# Altium project ARM.PrjPcb (part 2 of 2)

## Sheet 04-Accel.SchDoc
size A
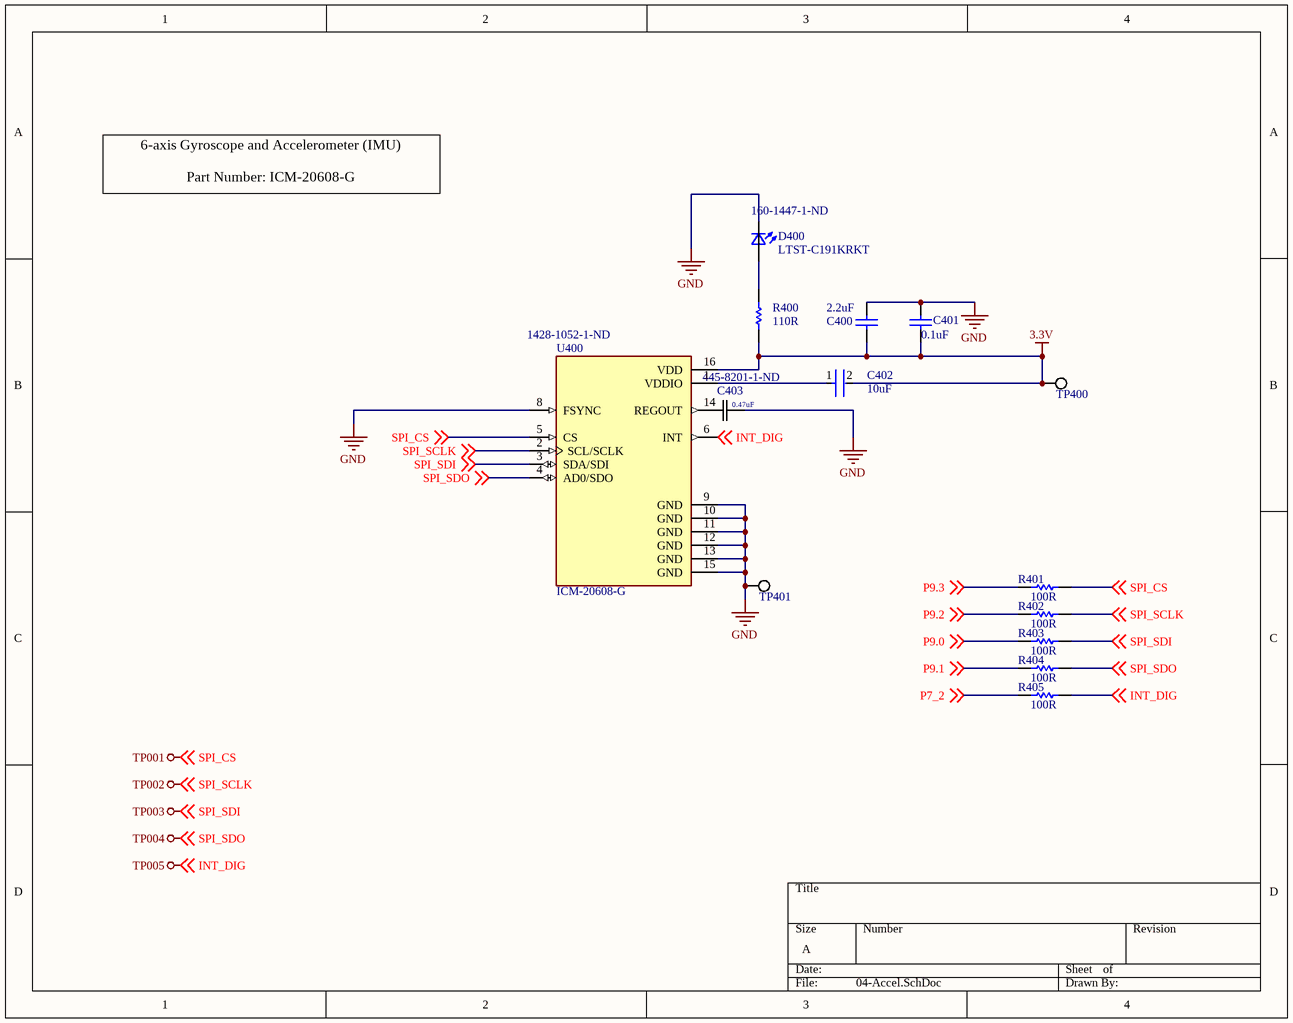
[diagram p3: 04-Accel.SchDoc]

### Parts
C400  2.2uF  [CAPC2013X145X50ML20T25]
C401  0.1uF  [CAPC2013X145X50LL20T25]
C402  10uF  [FP-C0805C-DN-MFG]
C403  0.47uF  Supplier Part Number 2: 445-8201-1-ND  [CAP_2012_TDK]
D400  LTST-C191KRKT  Supplier Part Number 1: 160-1447-1-ND  [0603]
R400  110R  [RESC2013X60X40NL20T25]
R401  100R  [RESC2013X60X40ML20T25]
R402  100R  [RESC2013X60X40ML20T25]
R403  100R  [RESC2013X60X40ML20T25]
R404  100R  [RESC2013X60X40ML20T25]
R405  100R  [RESC2013X60X40ML20T25]
TP400  5019  [KSTN-5019_V]  (value not drawn)
TP401  5019  [KSTN-5019_V]  (value not drawn)
U400  ICM-20608-G  Supplier Part Number 1: 1428-1052-1-ND  [PQFN50P300X300X80-16N]

### Nets
3.3V: C400.1 C401.1 C402.2 R400.1 TP400.1 U400.16(VDD)
GND: C400.2 C401.2 C403.2 D400.1(K2) TP401.1 U400.8(FSYNC) U400.9(GND) U400.10(GND) U400.11(GND) U400.12(GND) U400.13(GND) U400.15(GND)
TP001: R401.2 U400.5(CS) ; off-sheet SPI_CS  [also labelled SPI_CS]
TP002: R402.2 U400.2(SCL/SCLK) ; off-sheet SPI_SCLK  [also labelled SPI_SCLK]
TP003: R403.2 U400.3(SDA/SDI) ; off-sheet SPI_SDI  [also labelled SPI_SDI]
TP004: R404.2 U400.4(AD0/SDO) ; off-sheet SPI_SDO  [also labelled SPI_SDO]
TP005: R405.2 U400.6(INT) ; off-sheet INT_DIG  [also labelled INT_DIG]
P7_2: R405.1 ; off-sheet P7_2
P9.0: R403.1 ; off-sheet P9.0
P9.1: R404.1 ; off-sheet P9.1
P9.2: R402.1 ; off-sheet P9.2
P9.3: R401.1 ; off-sheet P9.3
NetC402_1: C402.1 U400.1(VDDIO)
NetD400_2: D400.2(A2) R400.2

Not connected (* = marked no-connect by the designer): C403 1; U400 14(REGOUT)

### Notes on the sheet
- 6-axis Gyroscope and Accelerometer (IMU)
  Part Number: ICM-20608-G

### Library data of the parts
C400 = CMP-1036-04819-2: Part Number: C0805C225K9PACTU; Manufacturer: Kemet
C401 = CMP-1036-04391-2: Manufacturer: Kemet; Part Number: C0805C104K9RACTU
C402 = CMP-1036-03808-3: CAP CER 10000PF 10V X7R 0805; Manufacturer Part Number: C0805C103K8RACTU; Manufacturer: KEMET; Material: Ceramic; Value: 10,000 pF; Temperature Coefficient: 30ppm/°C; Tolerance: 0.1; RoHS: TRUE; Lead Free: Yes; Temperature: -55°C to +125°C; Device Class L2: Capacitors; Temperature Characteristic: X7R; Device Class L1: Passive Components; Mouser Description: Multilayer Ceramic Capacitors MLCC - SMD/SMT 10volts 10000pF X7R 10%; Category: Cap; Ipc Land Pattern Name: CAPC200125X78; Height: 0.88mm; ComponentLink2URL: https://content.kemet.com/datasheets/KEM_C1003_C0G_SMD.pdf; Capacitance: 10,000 pF; Temperature Range High: +125°C; Automotive: No; ComponentLink2Description: Datasheet; Octopart: https://octopart.com/c0805c103k8ractu-kemet-12595572; Device Class L3: Ceramic Capacitors; Temperature Range Low: -55°C; Package: C0805C-DN; Voltage Rating: 10 V; Digikey Description: CAP CER 10000PF 10V X7R 0805
C403 = CGJ4J2X7R0J474K125AA: Cap Ceramic 0.47uF 6.3V X7R 10% Pad SMD 0805 125C Automotive T/R; Mfr_Name: TDK; Capacitance: 470nF; Ratings: COTS; Supplier 1: Digi-Key; Supplier 2: Digi-Key; Manufacturer: TDK; Manufacturer Part Number: CGJ4J2X7R0J474K125AA; RoHS: Yes; Category: Ceramic Capacitors; Stock 2: 1790; Pricing 2: 1=0.43000, 10=0.30400, 50=0.23020, 100=0.20040, 500=0.14848, 1000=0.12620 (USD); Mount: Surface Mount; Case/Package: 0805; Case Code (Metric): 2012; Case Code (Imperial): 0805; Weight: 0.000194oz; Min Operating Temperature: -55°C; Max Operating Temperature: 125°C; Voltage Rating: 6.3V; Tolerance: 10%; Packaging: Tape and Reel; Termination: SMD/SMT; Series: CGJ; Package Quantity: 2000; Voltage Rating (DC): 6.3V; Dielectric: X7R; Resistor Type: Ceramic; Length: 2mm; Width: 0.049inch; Height: 1.25mm; Thickness: 0.053inch; Depth: 1.25mm; Radiation Hardening: No; ComponentLink1URL: https://datasheet.ciiva.com/15192/getdatasheetpartid-712880-15192524.pdf?src-supplier=Verical; ComponentLink1Description: https://datasheet.ciiva.com/15192/getdatasheetpartid-712880-15192524.pdf?src-supplier=Verical; ComponentLink2URL: https://datasheet.ciiva.com/24216/mlcc-highreliability-general-en-520187-24216918.pdf?src-supplier=Mouser; ComponentLink2Description: https://datasheet.ciiva.com/24216/mlcc-highreliability-general-en-520187-24216918.pdf?src-supplier=Mouser
D400 = LTST-C191KRKT: LED Uni-Color Red 639nm 2-Pin Chip LED T/R / LED RED CLEAR 0603 SMD; Manufacturer: Vishay Lite-On; Lens Color: Colorless; Power Rating: 75mW; Luminous Intensity: 54mcd; Viewing Angle: 130°; Forward Voltage: 2V; Lens Style: Clear,Diffused,Colorless,Rectangular; Forward Current: 30mA; Dominant Wavelength: 631nm; Test Current: 20mA; Number of Elements: 1; Reverse Voltage: 5V; Package: None; MP: LTST-C191KRKT; Value: *; Availability: Unavailable; Price: None; Supplier 1: Digi-Key; Manufacturer Part Number: LTST-C191KRKT; RoHS: Yes; Category: LEDs; Stock 1: 862758; Pricing 1: 1=0.26000, 10=0.14100, 100=0.06560, 500=0.06060, 1000=0.04747, 2000=0.04646 (USD); Mount: Surface Mount; Case/Package: 0603; Number of Pins: 2; Color: Red; Case Code (Metric): 1608; Case Code (Imperial): 0603; Min Operating Temperature: -55°C; Max Operating Temperature: 85°C; Packaging: Tape and Reel; Package Quantity: 1; Illumination Color: Red; Lens Transparency: Clear; Power Dissipation: 75mW; Wavelength: 639nm; Number of LEDs: 1; Voltage: 2V; Length: 1.6mm; Width: 0.8mm; Height: 0.55mm; Depth: 0.8mm; Radiation Hardening: No; Lead Free: Lead Free; RoHS Compliant: Yes; ComponentLink1URL: https://datasheet.ciiva.com/12400/lite-on-ltst-c191krkt-190135-12400910.pdf?src-supplier=Mouser; ComponentLink1Description: https://datasheet.ciiva.com/12400/lite-on-ltst-c191krkt-190135-12400910.pdf?src-supplier=Mouser; ComponentLink2URL: https://datasheet.ciiva.com/16212/ltst-c191krkt-16212419.pdf?src-supplier=Future+Electronics; ComponentLink2Description: https://datasheet.ciiva.com/16212/ltst-c191krkt-16212419.pdf?src-supplier=Future+Electronics; ComponentLink3URL: https://datasheet.ciiva.com/15117/getdatasheetpartid-141922-15117737.pdf?src-supplier=Verical; ComponentLink3Description: https://datasheet.ciiva.com/15117/getdatasheetpartid-141922-15117737.pdf?src-supplier=Verical; ComponentLink4URL: https://datasheet.ciiva.com/11773/0900766b80dc02b2-11773601.pdf?src-supplier=Rs; ComponentLink4Description: https://datasheet.ciiva.com/11773/0900766b80dc02b2-11773601.pdf?src-supplier=Rs; ComponentLink5URL: https://datasheet.ciiva.com/2109/s-110-ltst-c191krkt-2109971.pdf?src-supplier=Digi-Key; ComponentLink5Description: https://datasheet.ciiva.com/2109/s-110-ltst-c191krkt-2109971.pdf?src-supplier=Digi-Key; ComponentLink6URL: https://datasheet.ciiva.com/2109/s-110-ltst-c191krkt-2109970.pdf?src-supplier=Digi-Key; ComponentLink6Description: https://datasheet.ciiva.com/2109/s-110-ltst-c191krkt-2109970.pdf?src-supplier=Digi-Key; ComponentLink7URL: https://datasheet.ciiva.com/2109/s-110-ltst-c191krkt-2109972.pdf?src-supplier=Digi-Key; ComponentLink7Description: https://datasheet.ciiva.com/2109/s-110-ltst-c191krkt-2109972.pdf?src-supplier=Digi-Key
R400 = CMP-2001-00585-1: Part Number: ERA6AEB111V; Manufacturer: Panasonic
R401-R405 = CMP-2001-00580-1: Manufacturer: Panasonic; Part Number: ERA6AEB101V
TP400 TP401 = CMP-1672-00008-1: Test Point, 1 Position SMD, RoHS, Tape and Reel; Manufacturer 1: Keystone Electronics; ComponentLink1Description: Manufacturer URL; Package Quantity: 1000; DatasheetVersion: 03/2014; Packaging: Tape and Reel; ComponentLink2URL: http://www.keyelco.com/product-pdf.cfm?p=1357; ComponentLink1URL: http://www.keyelco.com/; Mount: Surface Mount; Contact Plating: Silver; PackageDescription: 1-Pin Surface Mount Device, Body 3.81 x 2.03 mm; Pins: 1; RoHSCompliant: True; Mounting Technology: Surface Mount; ComponentLink2Description: Datasheet; PackageReference: 5019; Supplier 1: Digi-Key; Supplier Part Number 1: 36-5019CT-ND; Manufacturer Part Number 1: 5019; RoHS: Yes; Category: Connectors; Stock 1: 1316816; Pricing 1: 1=0.34000, 25=0.27360, 100=0.22340, 250=0.20064, 500=0.19152 (USD); Number of Pins: 1; Material: Bronze; Contact Material: Bronze; Series: 5019; Termination: SMD/SMT; Height: 0.09inch; RoHS Compliant: Yes; REACH SVHC: No SVHC; Lead Free: Lead Free; ComponentLink3URL: https://datasheet.ciiva.com/16318/m60-2p61-16318395.pdf?src-supplier=Future+Electronics; ComponentLink3Description: https://datasheet.ciiva.com/16318/m60-2p61-16318395.pdf?src-supplier=Future+Electronics; ComponentLink4URL: https://datasheet.ciiva.com/16885/70182998-16885945.pdf?src-supplier=Allied+Electronics; ComponentLink4Description: https://datasheet.ciiva.com/16885/70182998-16885945.pdf?src-supplier=Allied+Electronics; ComponentLink5URL: https://datasheet.ciiva.com/14848/m60-2p61-14848437.pdf?src-supplier=Digi-Key; ComponentLink5Description: https://datasheet.ciiva.com/14848/m60-2p61-14848437.pdf?src-supplier=Digi-Key; ComponentLink6URL: https://datasheet.ciiva.com/14848/m60-2p61-14848438.pdf?src-supplier=Digi-Key; ComponentLink6Description: https://datasheet.ciiva.com/14848/m60-2p61-14848438.pdf?src-supplier=Digi-Key; ComponentLink7URL: https://datasheet.ciiva.com/14848/m60-2p61-14848439.pdf?src-supplier=Digi-Key; ComponentLink7Description: https://datasheet.ciiva.com/14848/m60-2p61-14848439.pdf?src-supplier=Digi-Key
U400 = ICM-20608-G: MotionTracking Device Digital Output 1.8V 16-Pin LGA / IMU ACCEL/GYRO I2C/SPI 16LGA; MF: TDK InvenSense; Sensor Type: Accelerometer,Gyroscope,3 Axis; Output Type: SPI,I2C,Digital; Package: LGA-16 InvenSense; Purchase-URL: https://pricing.snapeda.com/search/part/ICM-20608-G/?ref=eda; Value: *; Price: None; Availability: Good; MP: ICM-20608-G; SnapEDA_Link: https://www.snapeda.com/parts/ICM-20608-G/TDK%20InvenSense/view-part/196551/?ref=snap; Supplier 1: Digi-Key; Manufacturer: TDK InvenSense; Manufacturer Part Number: ICM-20608-G; RoHS: No; Category: Inertial Measurement Units (IMUs); Stock 1: 18416; Pricing 1: 1=7.78000, 5=6.86600, 10=6.06500, 25=4.92040, 50=4.34820, 100=4.23370, 500=3.54718, 1000=3.31832 (USD); Mount: Surface Mount; Case/Package: LGA; Number of Pins: 16; Min Operating Temperature: -40°C; Max Operating Temperature: 85°C; RoHS Compliant: No; ComponentLink1URL: https://www.invensense.com/wp-content/uploads/2015/03/ICM-20608-G-Product-Brief-v1.0.pdf?src-supplier=Digi-Key; ComponentLink1Description: https://www.invensense.com/wp-content/uploads/2015/03/ICM-20608-G-Product-Brief-v1.0.pdf?src-supplier=Digi-Key

## Sheet 05-UARTBridge.SchDoc
size A
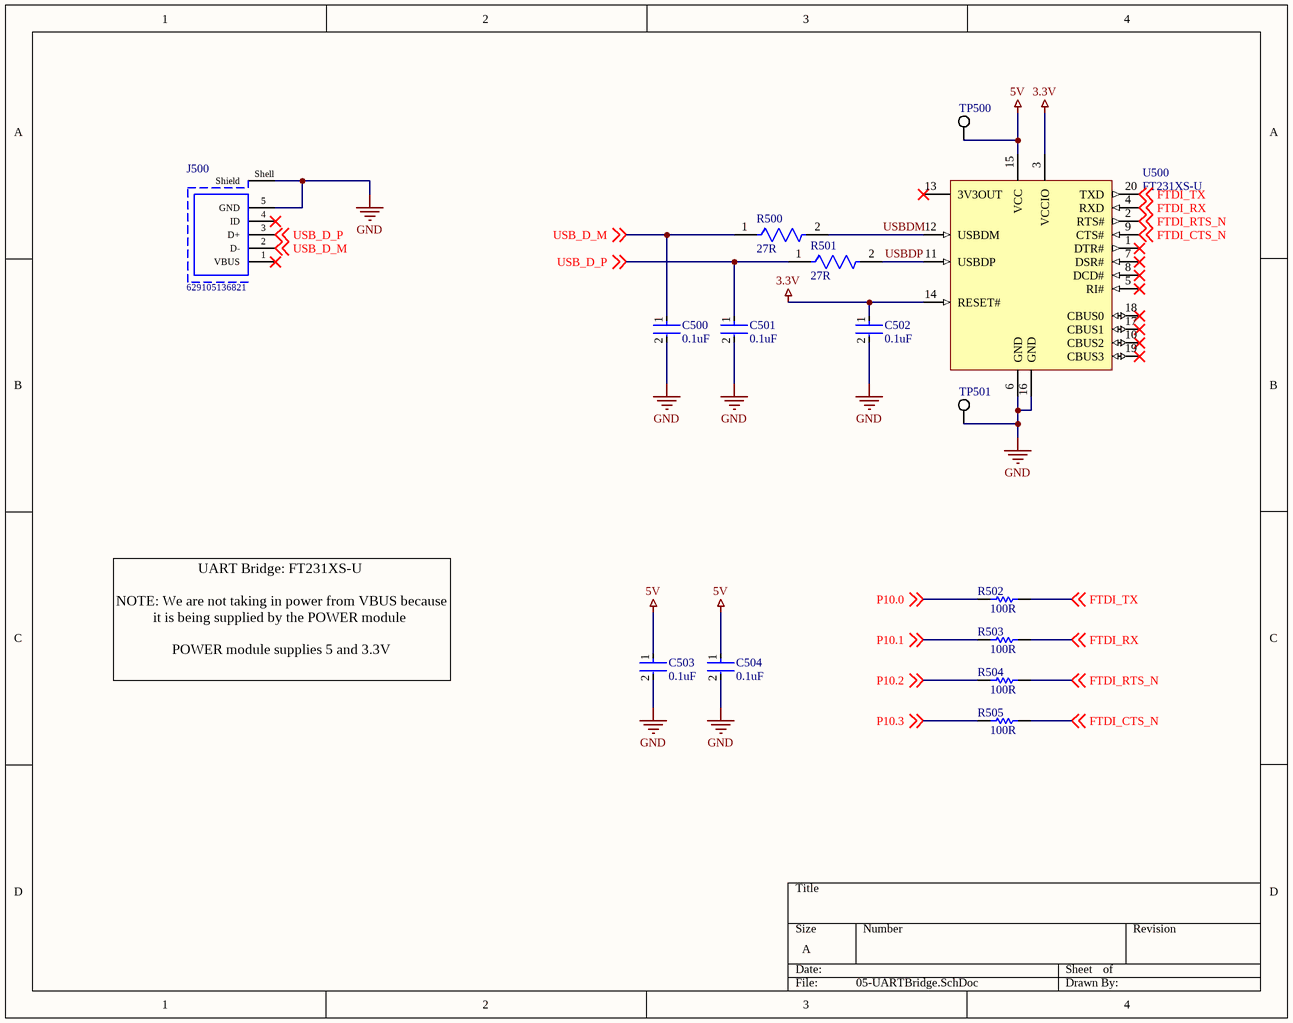
[diagram p4: 05-UARTBridge.SchDoc]

### Parts
C500  0.1uF  [FP-CL21-IPC_C]
C501  0.1uF  [FP-CL21-IPC_C]
C502  0.1uF  [FP-CL21-IPC_C]
C503  0.1uF  [FP-CL21-IPC_C]
C504  0.1uF  [FP-CL21-IPC_C]
J500  629105136821  [629105136821]
R500  27R  [FP-CRGCQ0805-IPC_C]
R501  27R  [FP-CRGCQ0805-IPC_C]
R502  100R  [RESC2013X60X40ML20T25]
R503  100R  [RESC2013X60X40ML20T25]
R504  100R  [RESC2013X60X40ML20T25]
R505  100R  [RESC2013X60X40ML20T25]
TP500  5019  [KSTN-5019_V]  (value not drawn)
TP501  5019  [KSTN-5019_V]  (value not drawn)
U500  FT231XS-U  [SSOP-20_L]

### Nets
3.3V: C502.1 U500.3(VCCIO) U500.14(RESET#)
5V: C503.1 C504.1 TP500.1 U500.15(VCC)
GND: C500.2 C501.2 C502.2 C503.2 C504.2 J500.5(GND) J500.Shell(Shield) TP501.1 U500.6(GND) U500.16(GND)
FTDI_CTS_N: R505.2 U500.9(CTS#) ; off-sheet FTDI_CTS_N
FTDI_RTS_N: R504.2 U500.2(RTS#) ; off-sheet FTDI_RTS_N
FTDI_RX: R503.2 U500.4(RXD) ; off-sheet FTDI_RX
FTDI_TX: R502.2 U500.20(TXD) ; off-sheet FTDI_TX
P10.0: R502.1 ; off-sheet P10.0
P10.1: R503.1 ; off-sheet P10.1
P10.2: R504.1 ; off-sheet P10.2
P10.3: R505.1 ; off-sheet P10.3
USB_D_M: C500.1 J500.2(D-) R500.1 ; off-sheet USB_D_M
USB_D_P: C501.1 J500.3(D+) R501.1 ; off-sheet USB_D_P
USBDM: R500.2 U500.12(USBDM)
USBDP: R501.2 U500.11(USBDP)

Not connected (* = marked no-connect by the designer): J500 1(VBUS)* 4(ID)*; U500 1(DTR#)* 5(RI#)* 7(DSR#)* 8(DCD#)* 10(CBUS2)* 13(3V3OUT)* 17(CBUS1)* 18(CBUS0)* 19(CBUS3)*

### Notes on the sheet
- UART Bridge: FT231XS-U
  NOTE: We are not taking in power from VBUS because it is being supplied by the POWER module
  POWER module supplies 5 and 3.3V

### Library data of the parts
C500-C504 = CMP-2000-05017-2: CL21 Series 0805 100nF 50V ±10% Tolerance X7R Multilayer Ceramic Chip Capacitor; Depth: 1.25mm; Height: 0.85mm; Width: 0.049inch; Tolerance: 10%; Case Code (Metric): 2012; Case Code (Imperial): 0805; Material: Ceramic; Thickness: 0.037inch; Min Operating Temperature: -55°C; Contact Plating: Tin; Length: 2mm; Mount: Surface Mount; Voltage Rating (DC): 50V; Lead Free: Lead Free; Dielectric: X7R; Radiation Hardening: No; Capacitance: 100nF; Voltage Rating: 50V; Case/Package: 0805; Packaging: Tape and Reel; Max Operating Temperature: 125°C; Voltage: 50V
J500 = CMP-1502-03253-1: Micro USB 2.0 Type B Receptacle WR-COM, Horizontal, SMT, with Pads and Pegs; Manufacturer: Wurth Elektronik; Contact Resistance: 30mOhm; Rated Current: 1A; Working Voltage: 30VAC; Datasheet URL: https://katalog.we-online.de/em/datasheet/629105136821.pdf; Mounting Technology: SMT; Publisher: WurthElektronik; Package Reference: 629105136821; Orientation: Horizontal; Packaging: TapeandReel; Part Number: 629105136821; Manufacturer URL: http://www.we-online.de; Connector Type: MicroUSB2.0TypeB; Gender: Receptacle; Operating Temperature: -40to105degC
R500 R501 = CMP-03211-007904-1: CRGCQ0805 27Ω 0.125W ±200ppm/°C 1% 150V; Manufacturer: TE Connectivity; Manufacturer Part Number: CRGCQ0805F27R; Automotive Grade: Grade 323; Tolerance: 0.01; Series: CRGCQ; Automotive: Yes; Temperature Range Low: -55°C; Voltage Rating: 150V; Height: 0.65mm; Power Rating: 0.125W; Temperature Coefficient: ±200ppm/°C; RoHS: TRUE; ComponentLink2Description: Datasheet; Package: CRGCQ0805; Temperature Range High: +155°C; Temperature: -55°C to +155°C; Ipc Land Pattern Name: RESC200125X55; Device Class L2: Resistors; Device Class L3: Chip SMD Resistors; ComponentLink2URL: https://www.te.com/commerce/DocumentDelivery/DDEController?Action=showdoc&DocId=Data+Sheet%7F1773204-3%7F1%7Fpdf%7FEnglish%7FENG_DS_1773204-3_1.pdf%7F4-2176341-332; Value: 27Ω; Mouser Description: Res General Purpose Thick Film 0805 27 Ohm 1% 1/8W ±200ppm/°C Molded Paper T/R; Octopart: https://octopart.com/crgcq0805f27r-te+connectivity-91018166; Lead Free: Yes; Composition: Thick Film; Ambient Temperature Range High: +70°C; Category: Res; Resistance: 27Ω; Device Class L1: Passive Components
R502-R505 = CMP-2001-00580-1: as R401 on sheet 04-Accel
TP500 TP501 = CMP-1672-00008-1: as TP400 on sheet 04-Accel; ComponentLink1Description: Manufacturer URL; Package Quantity: 1000; DatasheetVersion: 03/2014; Packaging: Tape and Reel; ComponentLink2URL: http://www.keyelco.com/product-pdf.cfm?p=1357; ComponentLink1URL: http://www.keyelco.com/; Mount: Surface Mount; Contact Plating: Silver; PackageDescription: 1-Pin Surface Mount Device, Body 3.81 x 2.03 mm; Pins: 1; RoHSCompliant: True; Mounting Technology: Surface Mount; ComponentLink2Description: Datasheet; PackageReference: 5019; Supplier 1: Digi-Key; Supplier Part Number 1: 36-5019CT-ND; Manufacturer Part Number 1: 5019; RoHS: Yes; Category: Connectors; Stock 1: 1316816; Pricing 1: 1=0.34000, 25=0.27360, 100=0.22340, 250=0.20064, 500=0.19152 (USD); Number of Pins: 1; Material: Bronze; Contact Material: Bronze; Series: 5019; Termination: SMD/SMT; Height: 0.09inch; RoHS Compliant: Yes; REACH SVHC: No SVHC; Lead Free: Lead Free; ComponentLink3URL: https://datasheet.ciiva.com/16318/m60-2p61-16318395.pdf?src-supplier=Future+Electronics; ComponentLink3Description: https://datasheet.ciiva.com/16318/m60-2p61-16318395.pdf?src-supplier=Future+Electronics; ComponentLink4URL: https://datasheet.ciiva.com/16885/70182998-16885945.pdf?src-supplier=Allied+Electronics; ComponentLink4Description: https://datasheet.ciiva.com/16885/70182998-16885945.pdf?src-supplier=Allied+Electronics; ComponentLink5URL: https://datasheet.ciiva.com/14848/m60-2p61-14848437.pdf?src-supplier=Digi-Key; ComponentLink5Description: https://datasheet.ciiva.com/14848/m60-2p61-14848437.pdf?src-supplier=Digi-Key; ComponentLink6URL: https://datasheet.ciiva.com/14848/m60-2p61-14848438.pdf?src-supplier=Digi-Key; ComponentLink6Description: https://datasheet.ciiva.com/14848/m60-2p61-14848438.pdf?src-supplier=Digi-Key; ComponentLink7URL: https://datasheet.ciiva.com/14848/m60-2p61-14848439.pdf?src-supplier=Digi-Key; ComponentLink7Description: https://datasheet.ciiva.com/14848/m60-2p61-14848439.pdf?src-supplier=Digi-Key
U500 = CMP-0248-00015-2: USB to Full-Handshake UART Interface Chip, UHCI/OHCI/EHCI Compatible, USB 2.0 Compatible, -40 to +85 degC, 20-Pin SSOP, Pb-Free, Tube; Manufacturer: FTDI; PackageDescription: 20-Pin Small Outline Package, 8.6 x 3.9 mm Body, 0.635 mm Pitch; ComponentLink2Description: Datasheet; DatasheetVersion: ver 1.2, Feb-2013; PackageReference: SSOP-20; ComponentLink3URL: www.ftdichip.com/Products/ICs/FT231X.html; ComponentLink2URL: http://www.ftdichip.com/Support/Documents/DataSheets/ICs/DS_FT231X.pdf; PartNumber: FT231XS-U; ComponentLink3Description: FT231X Product Page; ComponentLink1URL: http://www.ftdichip.com/; Code_JEDEC: MO-137-AD; ComponentLink1Description: Manufacturer URL; RevisionNote: DatasheetVersion updated to 1.2 Feb-2013; PackageVersion: Feb-13

## Nets that join several sheets
3.3V: 02-MCU (10 pins), 03-Power (7 pins), 04-Accel (6 pins), 05-UARTBridge (C502.1 U500.3 U500.14)
5V: 03-Power (6 pins), 05-UARTBridge (C503.1 C504.1 TP500.1 U500.15)
GND: 02-MCU (15 pins), 03-Power (12 pins), 04-Accel (12 pins), 05-UARTBridge (10 pins)
3V3_PWR_GOOD: 02-MCU (U200.1), 03-Power (LED300.2 R300.1 U300.1)
P7_2: 02-MCU (MD200.22), 04-Accel (R405.1)
P9.0: 02-MCU (MD200.17), 04-Accel (R403.1)
P9.1: 02-MCU (MD200.18), 04-Accel (R404.1)
P9.2: 02-MCU (MD200.21), 04-Accel (R402.1)
P9.3: 02-MCU (MD200.9), 04-Accel (R401.1)
P10.0: 02-MCU (MD200.13), 05-UARTBridge (R502.1)
P10.1: 02-MCU (MD200.12), 05-UARTBridge (R503.1)
P10.2: 02-MCU (MD200.33), 05-UARTBridge (R504.1)
P10.3: 02-MCU (MD200.7), 05-UARTBridge (R505.1)